# EAGLE design main (EAGLE 6.1)
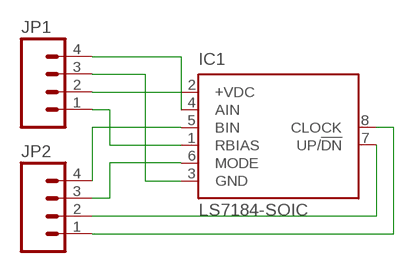
[diagram p0: schematic, sheet 1]

## Parts
IC1  LS7184-SOIC  [SOIC08]
JP1  M04LONGPADS  [1X04_LONGPADS]
JP2  M04LONGPADS  [1X04_LONGPADS]

## Nets
N$1: IC1.1(RBIAS) JP1.1
N$2: IC1.2(+VDC) JP1.2
N$3: IC1.3(GND) JP1.3
N$4: IC1.4(AIN) JP1.4
N$5: IC1.5(BIN) JP2.4
N$6: IC1.6(MODE) JP2.3
N$7: IC1.7(UP/!DN) JP2.2
N$8: IC1.8(CLOCK) JP2.1

## Library data of the parts
IC1 = optocoupler:LS7184: Encoder to Counter Interface Source: http://www.usdigital.com/products/ls7183-ls7184/ls7183 ls7184 Data Sheet.pdf; OC_FARNELL: unknown; OC_NEWARK: unknown
JP1 JP2 = SparkFun:M04: Header 4 Standard 4-pin 0.1" header. Use with straight break away headers (SKU : PRT-00116), right angle break away headers (PRT-00553), swiss pins (PRT-00743), machine pins (PRT-00117), and female headers (PRT-00115). Molex polarized connector foot print use with SKU : PRT-08231 with associated crimp pins and housings. 1MM SMD Version SKU: PRT-10208

## Board
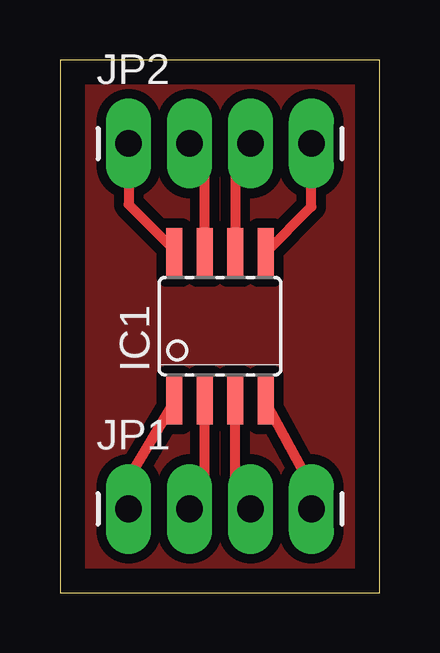
[diagram p1: board, top side]

Size 13.32 x 22.22 mm. Coordinates in mm from the lower left corner, seen from the top.
Outline: 0,0 13.32,0 13.32,22.22 0,22.22 0,0
Copper layers (1*16): Top 0.035mm / dielectric 1.5mm / Bottom 0.035mm
Design rules: minimum track width 10mil, minimum drill 24mil, track to track 8mil, track to pad 8mil, pad to pad 8mil, via to via 8mil, smd to smd 8mil, copper to edge 40mil, drill to drill 8mil, minimum pad ring 10mil, minimum via ring 8mil, stop-mask expansion 4mil, vias tented up to drill 0mil, thermal gap 10mil

### Footprints (pad centres in the part's own frame; a part is rotated, then mirrored left to right if it is on the bottom)
SOIC08 = smd 0.66 x 2.032: 1 -1.905,-3.073; 2 -0.635,-3.073; 3 0.635,-3.073; 4 1.905,-3.073; 5 1.905,3.073; 6 0.635,3.073; 7 -0.635,3.073; 8 -1.905,3.073
1X04_LONGPADS = drill 1.118 pad 1.88 long: 1 0,0; 2 2.54,0; 3 5.08,0; 4 7.62,0

### Placement (x,y rotation side)
IC1  6.67,11.11 0 top
JP1  2.86,3.49 0 top
JP2  2.86,18.73 0 top

### Tracks (layer width: path | path; a pad name or v marks a point on that pad's centre or on a via)
N$1
  Top 0.406: JP1.1 2.86,4.76 4.76,7.94 IC1.1
N$2
  Top 0.406: JP1.2 6.03,4.45 IC1.2
N$3
  Top 0.406: JP1.3 7.3,4.76 IC1.3
N$4
  Top 0.406: JP1.4 10.48,4.45 8.57,7.94 IC1.4
N$5
  Top 0.406: IC1.5 10.48,16.09 JP2.4
N$6
  Top 0.406: JP2.3 7.3,17.78 IC1.6
N$7
  Top 0.406: IC1.7 6.03,17.78 JP2.2
N$8
  Top 0.406: JP2.1 2.86,16.19 4.76,14.29 IC1.8
N$9
  pour Top (isolate 0.406): 0,22.22 13.33,22.22 13.33,0 0,0